# Altium schematic sheet stm32f4x7v.SchDoc
size A3
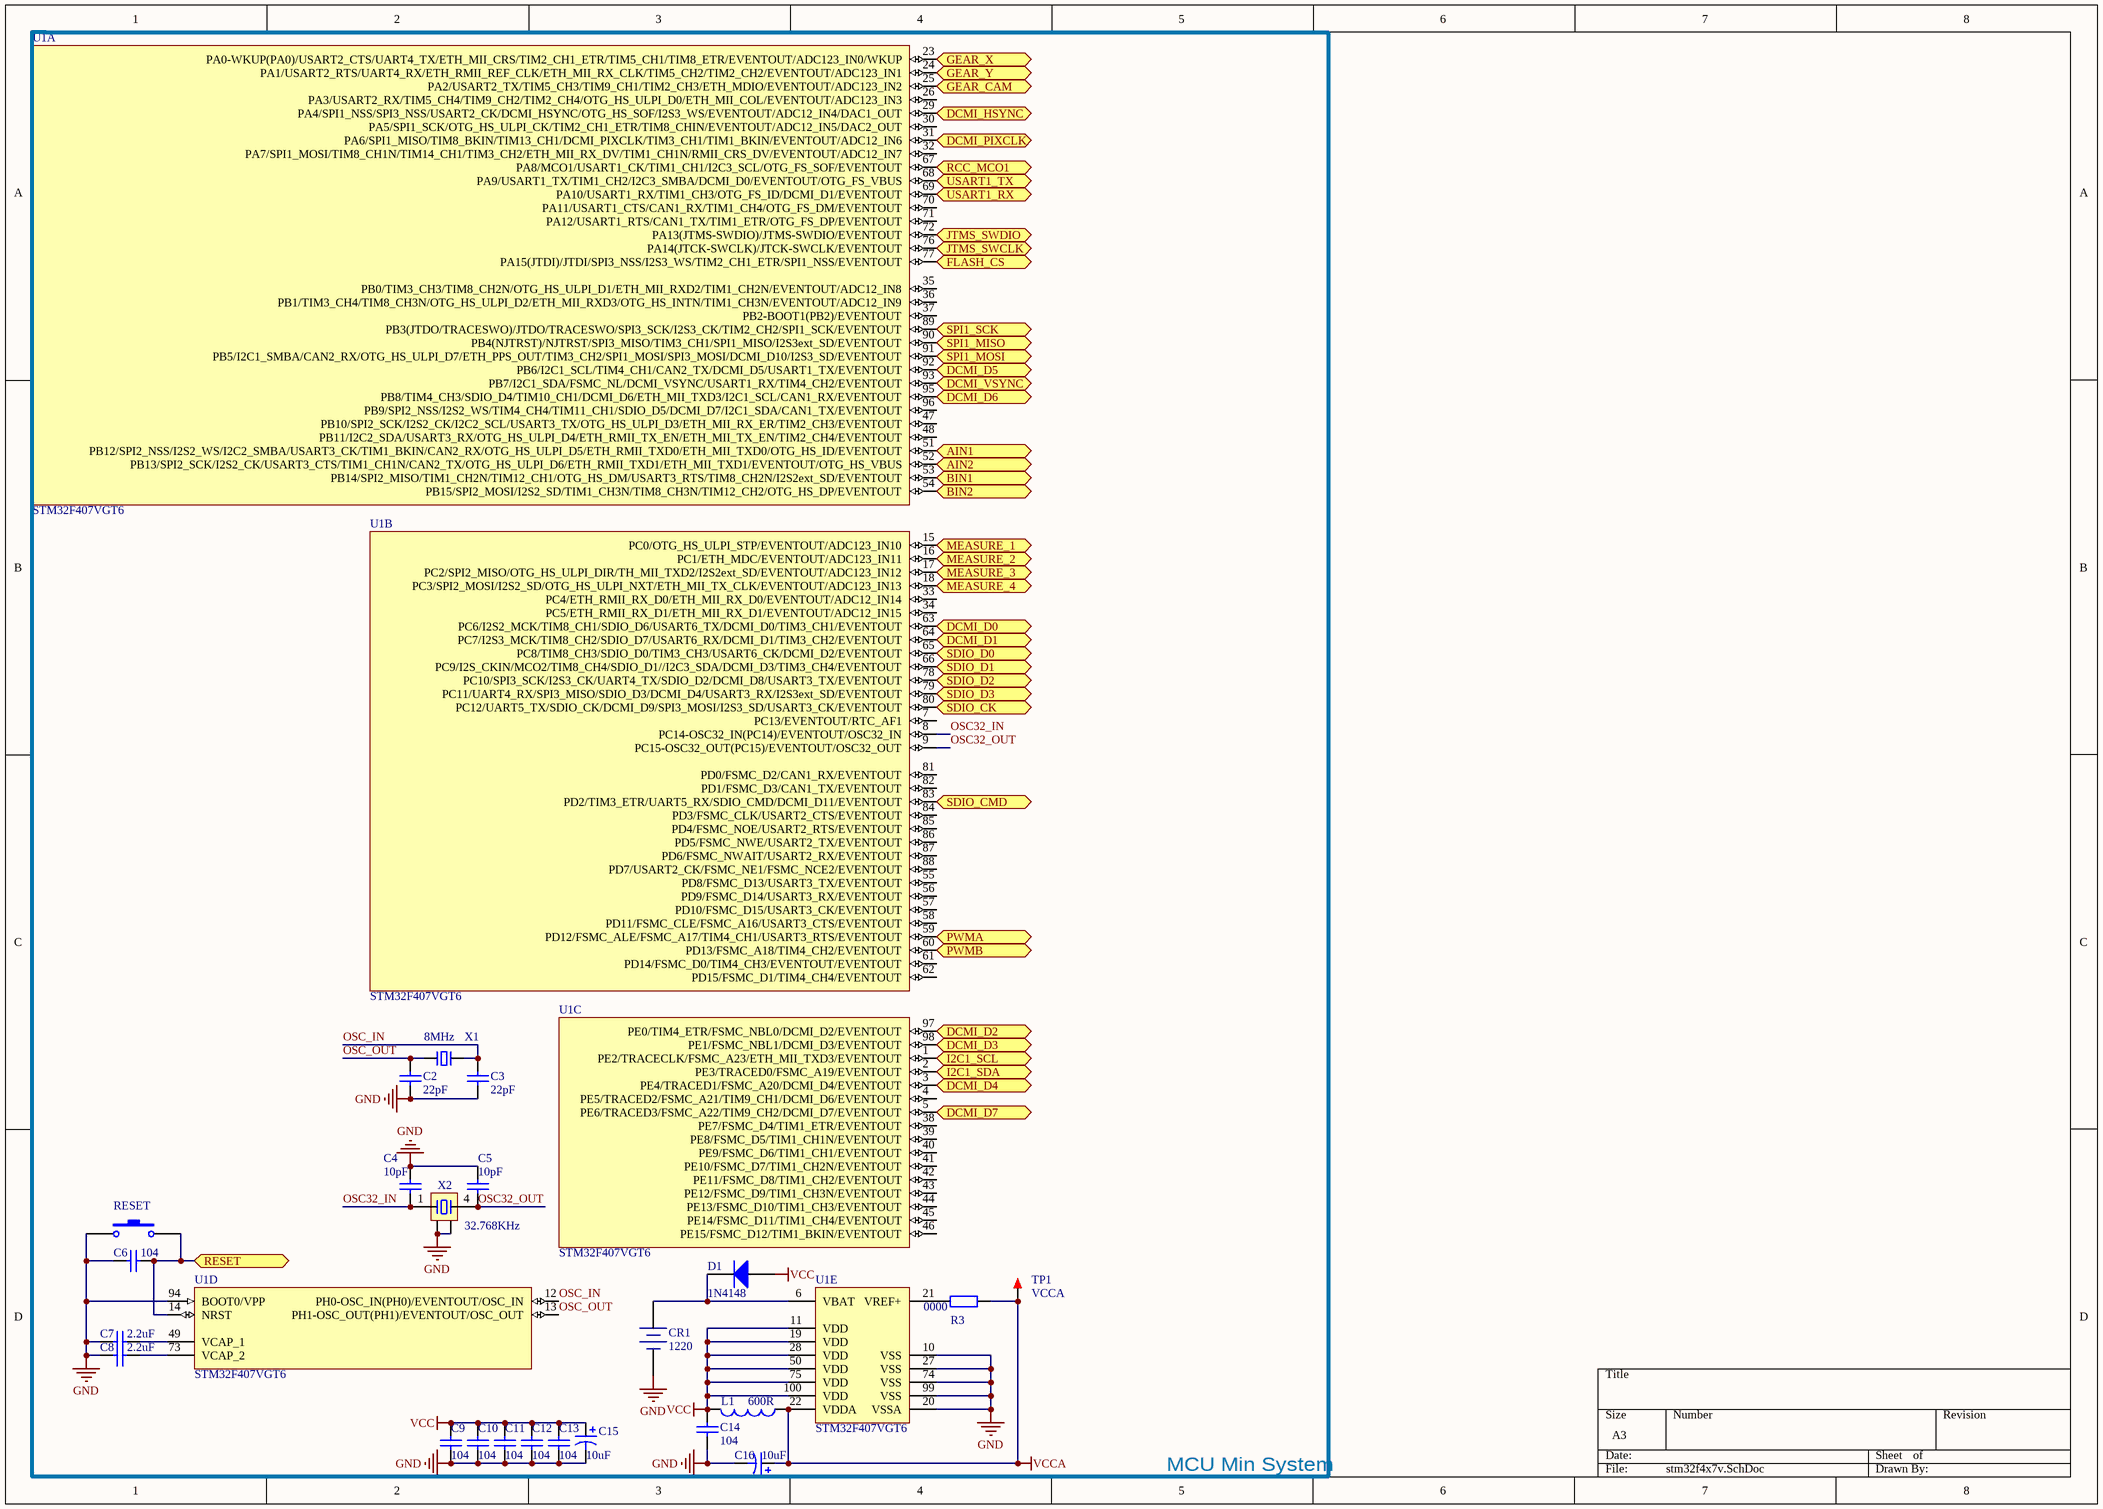
[diagram p0: stm32f4x7v.SchDoc]

## Parts
C2  22pF  [C 0603_L]
C3  22pF  [C 0603_L]
C4  10pF  [C 0603_L]
C5  10pF  [C 0603_L]
C6  104  [C 0603_L]
C7  2.2uF  [C 0603_L]
C8  2.2uF  [C 0603_L]
C9  104  [C 0603_L]
C10  104  [C 0603_L]
C11  104  [C 0603_L]
C12  104  [C 0603_L]
C13  104  [C 0603_L]
C14  104  [C 0603_L]
C15  10uF  [CD A(3216)]
C16  10uF  [CD A(3216)]
CR1  1220  [ML621FE]
D1  1N4148  [SOD-523]
L1  600R  [R 0603_L]
R3  0000  [R 0603_L]
RESET  RESET  [micro button_2_SMD]  (value not drawn)
TP1  VCCA  [TEST 0.8]
U1  STM32F407VGT6  [LQFP100 14x14_N]  (parts A,B,C,D,E of 5)
X1  8MHz  [OSC 5032-2P]
X2  32.768KHz  [OSC MC-146]

## Blocks framed on the sheet
MCU Min System: C2-C16 CR1 D1 L1 R3 RESET TP1 U1 X1 X2

## Ports
AIN1 (bidir), AIN2 (bidir), BIN1 (bidir), BIN2 (bidir), DCMI_D0 (bidir), DCMI_D1 (bidir), DCMI_D2 (bidir), DCMI_D3 (bidir), DCMI_D4 (bidir), DCMI_D5 (bidir), DCMI_D6 (bidir), DCMI_D7 (bidir), DCMI_HSYNC (bidir), DCMI_PIXCLK (bidir), DCMI_VSYNC (bidir), FLASH_CS (bidir), GEAR_CAM (bidir), GEAR_X (bidir), GEAR_Y (bidir), I2C1_SCL (bidir), I2C1_SDA (bidir), JTMS_SWCLK (bidir), JTMS_SWDIO (bidir), MEASURE_1 (bidir), MEASURE_2 (bidir), MEASURE_3 (bidir), MEASURE_4 (bidir), PWMA (bidir), PWMB (bidir), RCC_MCO1 (bidir), RESET (bidir), SDIO_CK (bidir), SDIO_CMD (bidir), SDIO_D0 (bidir), SDIO_D1 (bidir), SDIO_D2 (bidir), SDIO_D3 (bidir), SPI1_MISO (bidir), SPI1_MOSI (bidir), SPI1_SCK (bidir), USART1_RX (bidir), USART1_TX (bidir)

## Nets
GND: C2.1 C3.1 C4.2 C5.2 C6.1 C7.1 C8.1 C9.1 C10.1 C11.1 C12.1 C13.1 C14.1 C15.2 C16.2 CR1.2(DC-) RESET.1 U1.10(VSS) U1.20(VSSA) U1.27(VSS) U1.74(VSS) U1.94(BOOT0/VPP) U1.99(VSS) X2.2 X2.3
VCC: C9.2 C10.2 C11.2 C12.2 C13.2 C14.2 C15.1 D1.1(A) L1.2 U1.11(VDD) U1.19(VDD) U1.28(VDD) U1.50(VDD) U1.75(VDD) U1.100(VDD)
VCCA: C16.1 L1.1 R3.1 TP1.1 U1.22(VDDA)
AIN1: U1.51(PB12/SPI2_NSS/I2S2_WS/I2C2_SMBA/USART3_CK/TIM1_BKIN/CAN2_RX/OTG_HS_ULPI_D5/ETH_RMII_TXD0/ETH_MII_TXD0/OTG_HS_ID/EVENTOUT) ; port AIN1
AIN2: U1.52(PB13/SPI2_SCK/I2S2_CK/USART3_CTS/TIM1_CH1N/CAN2_TX/OTG_HS_ULPI_D6/ETH_RMII_TXD1/ETH_MII_TXD1/EVENTOUT/OTG_HS_VBUS) ; port AIN2
BIN1: U1.53(PB14/SPI2_MISO/TIM1_CH2N/TIM12_CH1/OTG_HS_DM/USART3_RTS/TIM8_CH2N/I2S2ext_SD/EVENTOUT) ; port BIN1
BIN2: U1.54(PB15/SPI2_MOSI/I2S2_SD/TIM1_CH3N/TIM8_CH3N/TIM12_CH2/OTG_HS_DP/EVENTOUT) ; port BIN2
DCMI_D0: U1.63(PC6/I2S2_MCK/TIM8_CH1/SDIO_D6/USART6_TX/DCMI_D0/TIM3_CH1/EVENTOUT) ; port DCMI_D0
DCMI_D1: U1.64(PC7/I2S3_MCK/TIM8_CH2/SDIO_D7/USART6_RX/DCMI_D1/TIM3_CH2/EVENTOUT) ; port DCMI_D1
DCMI_D2: U1.97(PE0/TIM4_ETR/FSMC_NBL0/DCMI_D2/EVENTOUT) ; port DCMI_D2
DCMI_D3: U1.98(PE1/FSMC_NBL1/DCMI_D3/EVENTOUT) ; port DCMI_D3
DCMI_D4: U1.3(PE4/TRACED1/FSMC_A20/DCMI_D4/EVENTOUT) ; port DCMI_D4
DCMI_D5: U1.92(PB6/I2C1_SCL/TIM4_CH1/CAN2_TX/DCMI_D5/USART1_TX/EVENTOUT) ; port DCMI_D5
DCMI_D6: U1.95(PB8/TIM4_CH3/SDIO_D4/TIM10_CH1/DCMI_D6/ETH_MII_TXD3/I2C1_SCL/CAN1_RX/EVENTOUT) ; port DCMI_D6
DCMI_D7: U1.5(PE6/TRACED3/FSMC_A22/TIM9_CH2/DCMI_D7/EVENTOUT) ; port DCMI_D7
DCMI_HSYNC: U1.29(PA4/SPI1_NSS/SPI3_NSS/USART2_CK/DCMI_HSYNC/OTG_HS_SOF/I2S3_WS/EVENTOUT/ADC12_IN4/DAC1_OUT) ; port DCMI_HSYNC
DCMI_PIXCLK: U1.31(PA6/SPI1_MISO/TIM8_BKIN/TIM13_CH1/DCMI_PIXCLK/TIM3_CH1/TIM1_BKIN/EVENTOUT/ADC12_IN6) ; port DCMI_PIXCLK
DCMI_VSYNC: U1.93(PB7/I2C1_SDA/FSMC_NL/DCMI_VSYNC/USART1_RX/TIM4_CH2/EVENTOUT) ; port DCMI_VSYNC
FLASH_CS: U1.77(PA15(JTDI)/JTDI/SPI3_NSS/I2S3_WS/TIM2_CH1_ETR/SPI1_NSS/EVENTOUT) ; port FLASH_CS
GEAR_CAM: U1.25(PA2/USART2_TX/TIM5_CH3/TIM9_CH1/TIM2_CH3/ETH_MDIO/EVENTOUT/ADC123_IN2) ; port GEAR_CAM
GEAR_X: U1.23(PA0-WKUP(PA0)/USART2_CTS/UART4_TX/ETH_MII_CRS/TIM2_CH1_ETR/TIM5_CH1/TIM8_ETR/EVENTOUT/ADC123_IN0/WKUP) ; port GEAR_X
GEAR_Y: U1.24(PA1/USART2_RTS/UART4_RX/ETH_RMII_REF_CLK/ETH_MII_RX_CLK/TIM5_CH2/TIM2_CH2/EVENTOUT/ADC123_IN1) ; port GEAR_Y
I2C1_SCL: U1.1(PE2/TRACECLK/FSMC_A23/ETH_MII_TXD3/EVENTOUT) ; port I2C1_SCL
I2C1_SDA: U1.2(PE3/TRACED0/FSMC_A19/EVENTOUT) ; port I2C1_SDA
JTMS_SWCLK: U1.76(PA14(JTCK-SWCLK)/JTCK-SWCLK/EVENTOUT) ; port JTMS_SWCLK
JTMS_SWDIO: U1.72(PA13(JTMS-SWDIO)/JTMS-SWDIO/EVENTOUT) ; port JTMS_SWDIO
MEASURE_1: U1.15(PC0/OTG_HS_ULPI_STP/EVENTOUT/ADC123_IN10) ; port MEASURE_1
MEASURE_2: U1.16(PC1/ETH_MDC/EVENTOUT/ADC123_IN11) ; port MEASURE_2
MEASURE_3: U1.17(PC2/SPI2_MISO/OTG_HS_ULPI_DIR/TH_MII_TXD2/I2S2ext_SD/EVENTOUT/ADC123_IN12) ; port MEASURE_3
MEASURE_4: U1.18(PC3/SPI2_MOSI/I2S2_SD/OTG_HS_ULPI_NXT/ETH_MII_TX_CLK/EVENTOUT/ADC123_IN13) ; port MEASURE_4
OSC32_IN: C4.1 U1.8(PC14-OSC32_IN(PC14)/EVENTOUT/OSC32_IN) X2.1
OSC32_OUT: C5.1 U1.9(PC15-OSC32_OUT(PC15)/EVENTOUT/OSC32_OUT) X2.4
OSC_IN: C3.2 U1.12(PH0-OSC_IN(PH0)/EVENTOUT/OSC_IN) X1.2
OSC_OUT: C2.2 U1.13(PH1-OSC_OUT(PH1)/EVENTOUT/OSC_OUT) X1.1
PWMA: U1.59(PD12/FSMC_ALE/FSMC_A17/TIM4_CH1/USART3_RTS/EVENTOUT) ; port PWMA
PWMB: U1.60(PD13/FSMC_A18/TIM4_CH2/EVENTOUT) ; port PWMB
RCC_MCO1: U1.67(PA8/MCO1/USART1_CK/TIM1_CH1/I2C3_SCL/OTG_FS_SOF/EVENTOUT) ; port RCC_MCO1
RESET: C6.2 RESET.2 U1.14(NRST) ; port RESET
SDIO_CK: U1.80(PC12/UART5_TX/SDIO_CK/DCMI_D9/SPI3_MOSI/I2S3_SD/USART3_CK/EVENTOUT) ; port SDIO_CK
SDIO_CMD: U1.83(PD2/TIM3_ETR/UART5_RX/SDIO_CMD/DCMI_D11/EVENTOUT) ; port SDIO_CMD
SDIO_D0: U1.65(PC8/TIM8_CH3/SDIO_D0/TIM3_CH3/USART6_CK/DCMI_D2/EVENTOUT) ; port SDIO_D0
SDIO_D1: U1.66(PC9/I2S_CKIN/MCO2/TIM8_CH4/SDIO_D1//I2C3_SDA/DCMI_D3/TIM3_CH4/EVENTOUT) ; port SDIO_D1
SDIO_D2: U1.78(PC10/SPI3_SCK/I2S3_CK/UART4_TX/SDIO_D2/DCMI_D8/USART3_TX/EVENTOUT) ; port SDIO_D2
SDIO_D3: U1.79(PC11/UART4_RX/SPI3_MISO/SDIO_D3/DCMI_D4/USART3_RX/I2S3ext_SD/EVENTOUT) ; port SDIO_D3
SPI1_MISO: U1.90(PB4(NJTRST)/NJTRST/SPI3_MISO/TIM3_CH1/SPI1_MISO/I2S3ext_SD/EVENTOUT) ; port SPI1_MISO
SPI1_MOSI: U1.91(PB5/I2C1_SMBA/CAN2_RX/OTG_HS_ULPI_D7/ETH_PPS_OUT/TIM3_CH2/SPI1_MOSI/SPI3_MOSI/DCMI_D10/I2S3_SD/EVENTOUT) ; port SPI1_MOSI
SPI1_SCK: U1.89(PB3(JTDO/TRACESWO)/JTDO/TRACESWO/SPI3_SCK/I2S3_CK/TIM2_CH2/SPI1_SCK/EVENTOUT) ; port SPI1_SCK
USART1_RX: U1.69(PA10/USART1_RX/TIM1_CH3/OTG_FS_ID/DCMI_D1/EVENTOUT) ; port USART1_RX
USART1_TX: U1.68(PA9/USART1_TX/TIM1_CH2/I2C3_SMBA/DCMI_D0/EVENTOUT/OTG_FS_VBUS) ; port USART1_TX
NetC7_2: C7.2 U1.49(VCAP_1)
NetC8_2: C8.2 U1.73(VCAP_2)
NetCR1_1: CR1.1(DC+) D1.2(K) U1.6(VBAT)
NetR3_2: R3.2 U1.21(VREF+)

Not connected (* = marked no-connect by the designer): U1 4(PE5/TRACED2/FSMC_A21/TIM9_CH1/DCMI_D6/EVENTOUT) 7(PC13/EVENTOUT/RTC_AF1) 26(PA3/USART2_RX/TIM5_CH4/TIM9_CH2/TIM2_CH4/OTG_HS_ULPI_D0/ETH_MII_COL/EVENTOUT/ADC123_IN3) 30(PA5/SPI1_SCK/OTG_HS_ULPI_CK/TIM2_CH1_ETR/TIM8_CHIN/EVENTOUT/ADC12_IN5/DAC2_OUT) 32(PA7/SPI1_MOSI/TIM8_CH1N/TIM14_CH1/TIM3_CH2/ETH_MII_RX_DV/TIM1_CH1N/RMII_CRS_DV/EVENTOUT/ADC12_IN7) 33(PC4/ETH_RMII_RX_D0/ETH_MII_RX_D0/EVENTOUT/ADC12_IN14) 34(PC5/ETH_RMII_RX_D1/ETH_MII_RX_D1/EVENTOUT/ADC12_IN15) 35(PB0/TIM3_CH3/TIM8_CH2N/OTG_HS_ULPI_D1/ETH_MII_RXD2/TIM1_CH2N/EVENTOUT/ADC12_IN8) 36(PB1/TIM3_CH4/TIM8_CH3N/OTG_HS_ULPI_D2/ETH_MII_RXD3/OTG_HS_INTN/TIM1_CH3N/EVENTOUT/ADC12_IN9) 37(PB2-BOOT1(PB2)/EVENTOUT) 38(PE7/FSMC_D4/TIM1_ETR/EVENTOUT) 39(PE8/FSMC_D5/TIM1_CH1N/EVENTOUT) 40(PE9/FSMC_D6/TIM1_CH1/EVENTOUT) 41(PE10/FSMC_D7/TIM1_CH2N/EVENTOUT) 42(PE11/FSMC_D8/TIM1_CH2/EVENTOUT) 43(PE12/FSMC_D9/TIM1_CH3N/EVENTOUT) 44(PE13/FSMC_D10/TIM1_CH3/EVENTOUT) 45(PE14/FSMC_D11/TIM1_CH4/EVENTOUT) 46(PE15/FSMC_D12/TIM1_BKIN/EVENTOUT) 47(PB10/SPI2_SCK/I2S2_CK/I2C2_SCL/USART3_TX/OTG_HS_ULPI_D3/ETH_MII_RX_ER/TIM2_CH3/EVENTOUT) 48(PB11/I2C2_SDA/USART3_RX/OTG_HS_ULPI_D4/ETH_RMII_TX_EN/ETH_MII_TX_EN/TIM2_CH4/EVENTOUT) 55(PD8/FSMC_D13/USART3_TX/EVENTOUT) 56(PD9/FSMC_D14/USART3_RX/EVENTOUT) 57(PD10/FSMC_D15/USART3_CK/EVENTOUT) 58(PD11/FSMC_CLE/FSMC_A16/USART3_CTS/EVENTOUT) 61(PD14/FSMC_D0/TIM4_CH3/EVENTOUT/EVENTOUT) 62(PD15/FSMC_D1/TIM4_CH4/EVENTOUT) 70(PA11/USART1_CTS/CAN1_RX/TIM1_CH4/OTG_FS_DM/EVENTOUT) 71(PA12/USART1_RTS/CAN1_TX/TIM1_ETR/OTG_FS_DP/EVENTOUT) 81(PD0/FSMC_D2/CAN1_RX/EVENTOUT) 82(PD1/FSMC_D3/CAN1_TX/EVENTOUT) 84(PD3/FSMC_CLK/USART2_CTS/EVENTOUT) 85(PD4/FSMC_NOE/USART2_RTS/EVENTOUT) 86(PD5/FSMC_NWE/USART2_TX/EVENTOUT) 87(PD6/FSMC_NWAIT/USART2_RX/EVENTOUT) 88(PD7/USART2_CK/FSMC_NE1/FSMC_NCE2/EVENTOUT) 96(PB9/SPI2_NSS/I2S2_WS/TIM4_CH4/TIM11_CH1/SDIO_D5/DCMI_D7/I2C1_SDA/CAN1_TX/EVENTOUT)

## Library data of the parts
C2-C14 = Cap: Capacitor; Published: 8-Jun-2000; LatestRevisionDate: 17-Jul-2002; LatestRevisionNote: Re-released for DXP Platform.; PackageReference: RAD-0.3; Publisher: Altium Limited; PackageDescription: Radial Cap, Thru-Hole; 2 Leads; 0.3 in Pin Spacing
  C2 C3: Value: 22pF
  C4 C5: Value: 10pF
  C6 C9-C14: Value: 104
  C7 C8: Value: 2.2uF
C15 C16 = Cap Pol1: Polarized Capacitor (Radial); Published: 8-Jun-2000; LatestRevisionDate: 17-Jul-2002; LatestRevisionNote: Re-released for DXP Platform.; PackageReference: RB7.6-15; Publisher: Altium Limited; PackageDescription: Polarized Capacitor (Radial); 2 Leads; Value: 10uF
CR1 = CR-3V: 微型电池; 版权归属: 源创客; BOM名称: 微型电池; 学习资源: www.ooocke.com
D1 = Diode 1N4148: High Conductance Fast Diode; Published: 8-Jun-2000; LatestRevisionDate: 17-Jul-2002; LatestRevisionNote: Re-released for DXP Platform.; DatasheetVersion: 1997; PackageReference: DO-35; Publisher: Altium Limited; PackageDescription: Diode, Axial; Body 3.8 x 1.9 mm (LxDia. max), Lead Dia. 0.53 mm (max); Code_JEDEC: DO-204-AH; ComponentLink1Description: Manufacturer Link; ComponentLink1URL: http://www.fairchildsemi.com/; ComponentLink2Description: Datasheet; ComponentLink2URL: http://www.fairchildsemi.com/ds/1N%2F1N4148.pdf
L1 = Inductor: Code_IEC: 1005; Published: 8-Jun-2000; LatestRevisionDate: 29-May-2009; LatestRevisionNote: IPC-7351 Footprint Added.; PackageReference: 0402-A; Publisher: Altium Limited; PackageDescription: Chip Inductor; Code_JEITA: 0402; Value: 600R
R3 = Res2: Resistor; Published: 8-Jun-2000; LatestRevisionDate: 17-Jul-2002; LatestRevisionNote: Re-released for DXP Platform.; PackageReference: AXIAL-0.4; Publisher: Altium Limited; PackageDescription: Axial Device, Thru-Hole; 2 Leads; 0.4 in Pin Spacing; Value: 0000
RESET = SW-PB: Switch; Published: 24-Mar-1999; LatestRevisionDate: 17-Jul-2002; LatestRevisionNote: Re-released for DXP Platform.; PackageReference: SPST-2; Publisher: Altium Limited; PackageDescription: Switch; 2 Leads
TP1 = TEST: 测试点; 版权归属: 源创客; BOM名称: 测试点; 学习资源: www.ooocke.com
U1 = STM32F407VGT6: ARM Cortex-M4 32b MCU+FPU, 210DMIP, 1024 kB Flash, 192+4 kB RAM, Camera, 82 I/Os, 100-pin LQFP, -40 to +85癈, Tray; Internal RAM: 192kB; Operating Frequency (Processor Speed): 168MHz; A/D Converter: 16x12-bit; D/A Converter: 2x12-bit; 16-bit Timers (IC/OC/PWM): 12x16-bit(24/24/30); 32-bit Timer (IC/OC/PWM): 2x32-bit (8/8/8); Other Timer Functions: 2xWDG, RTC, 24-bit down counter; Serial Interface: 3xSPI/2xI2S/2xI2C/3xUSART(IrDa, ISO7816)/3xUART/2xUSB OTG FS/HS, 2xCAN/Ethernet MAC10/100, SDIO; DatasheetVersion: rev2, Jan-2012; PackageVersion: 2012; PackageReference: LQFP100; PackageDescription: 100-Pin Low Profile Quad Flat Package, 14x14 mm Body, 0.5 mm Pitch; ComponentLink1Description: Manufacturer URL; ComponentLink1URL: http://www.st.com/; ComponentLink2Description: STM32F405/7 Datasheet; ComponentLink2URL: http://www.st.com/internet/com/TECHNICAL_RESOURCES/TECHNICAL_LITERATURE/DATASHEET/DM00037051.pdf; ComponentLink3Description: STM32F4 Web Page; ComponentLink3URL: http://www.st.com/internet/mcu/subclass/1521.jsp
X1 = XTAL-2P: 2脚无源脚晶振; 版权归属: 源创客; BOM名称: 2脚无源脚晶振; 学习资源: www.ooocke.com
X2 = XTAL-MC-4P: MC系列4脚晶振; BOM名称: 2脚无源脚晶振; 版权归属: 源创客; 学习资源: www.ooocke.com